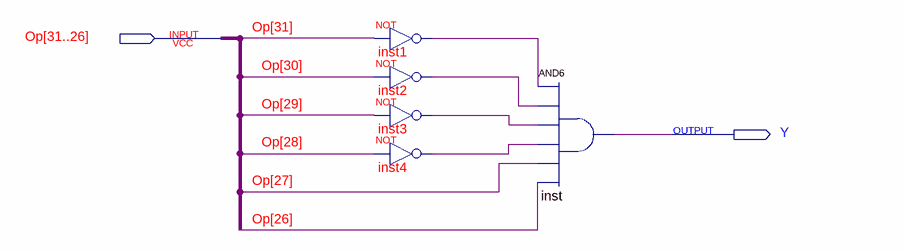
[diagram p0: schematic sheet]
// Quartus schematic JAL.bdf as structural Verilog: 5 symbols, 2 pins
module JAL (
  input  [31:26] Op,
  output Y
);

  wire inst1_out, inst2_out, inst3_out, inst4_out;

  not inst1 (inst1_out, Op[31]);
  not inst2 (inst2_out, Op[30]);
  not inst3 (inst3_out, Op[29]);
  not inst4 (inst4_out, Op[28]);
  and inst (Y, inst1_out, inst2_out, inst3_out, inst4_out, Op[27], Op[26]);
endmodule
